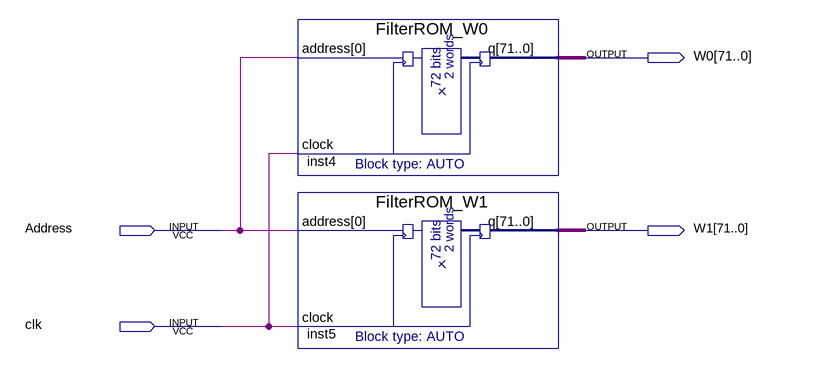
[diagram p0: schematic sheet]
// Quartus schematic Filter.bdf as structural Verilog: 2 symbols, 4 pins
module Filter (
  input  Address,
  input  clk,
  output [71:0] W0,
  output [71:0] W1
);

  FilterROM_W0 inst4 (.address(Address), .clock(clk), .q(W0));
  FilterROM_W1 inst5 (.address(Address), .clock(clk), .q(W1));
endmodule
